# EAGLE design pic16f84a (EAGLE 7.1.0)
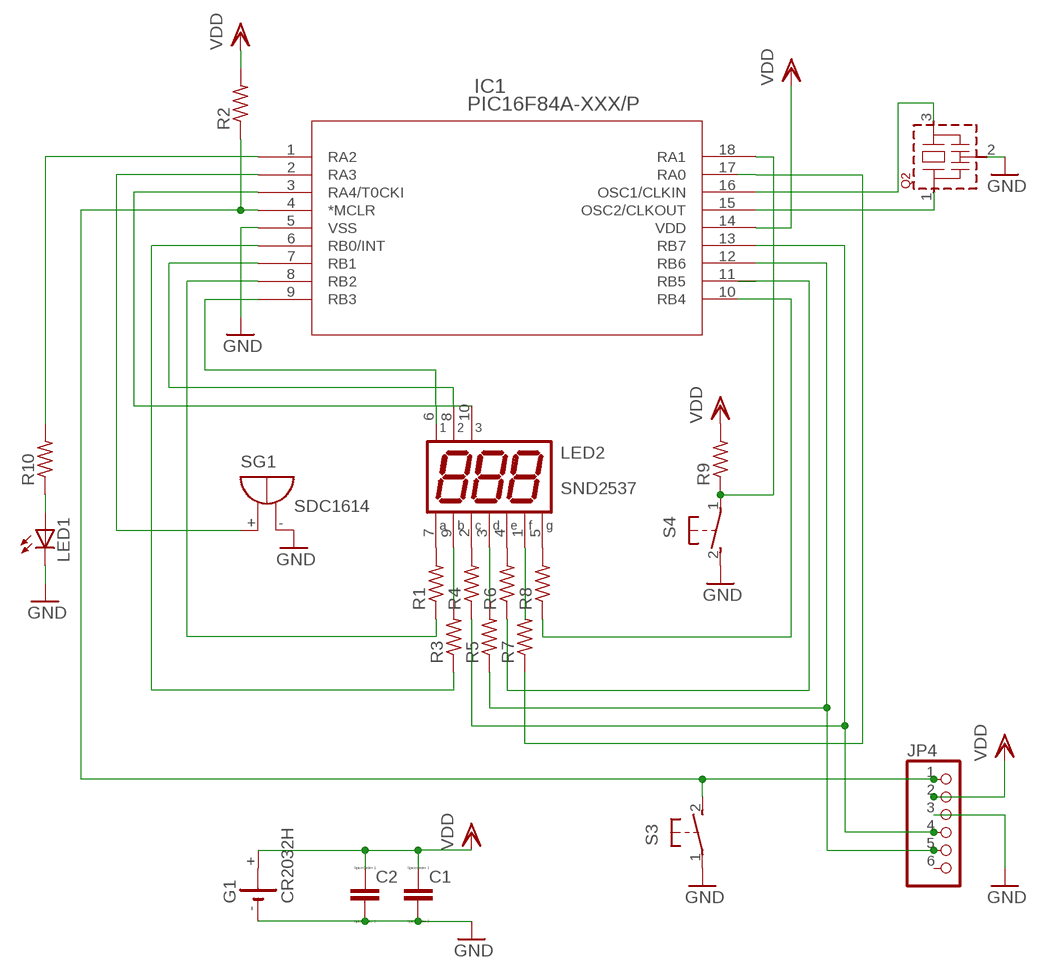
[diagram p0: schematic, sheet 1]

## Parts
C1  C-EU050-025X075  [C050-025X075]
C2  C-EU050-025X075  [C050-025X075]
G1  CR2032H  [CR2032H]
IC1  PIC16F84A-XXX/P  [PDIP18_300MC]
JP4  PINHD-1X6  [1X06]
LED1  LED3MM  [LED3MM]
LED2  SND2537  [SND2537-PKG]
Q2  CSTLS_X  [CSTLS_X]
R1  R-US_0207/10  [0207/10]
R2  R-US_0207/10  [0207/10]
R3  R-US_0207/10  [0207/10]
R4  R-US_0207/10  [0207/10]
R5  R-US_0207/10  [0207/10]
R6  R-US_0207/10  [0207/10]
R7  R-US_0207/10  [0207/10]
R8  R-US_0207/10  [0207/10]
R9  R-US_0207/10  [0207/10]
R10  R-US_0207/10  [0207/10]
S3  31-XX  [B3F-31XX]
S4  31-XX  [B3F-31XX]
SG1  SDC1614  [SDC1614]

## Nets
GND: C1.2 C2.2 G1.- IC1.5(VSS) JP4.3 LED1.K(C) Q2.2(VSS) S3.1(P) S4.2(S) SG1.-
N$1: IC1.13(RB7) JP4.4 R4.1
N$2: IC1.3(RA4/T0CKI) LED2.10
N$3: IC1.10(RB4) R8.1
N$5: IC1.15(OSC2/CLKOUT) Q2.1
N$6: IC1.8(RB2) R1.1
N$7: IC1.2(RA3) SG1.+
N$8: IC1.18(RA1) R9.1 S4.1(P)
N$9: IC1.11(RB5) R6.1
N$10: IC1.1(RA2) R10.2
N$11: IC1.17(RA0) R7.1
N$12: IC1.12(RB6) JP4.5 R5.1
N$13: LED2.7(A) R1.2
N$15: LED2.9(B) R3.2
N$16: LED2.2(C) R4.2
N$17: LED1.A R10.1
N$18: IC1.9(RB3) LED2.6
N$19: LED2.3(D) R5.2
N$20: LED2.4(E) R6.2
N$21: LED2.1(F) R7.2
N$22: LED2.5(G) R8.2
N$23: IC1.16(OSC1/CLKIN) Q2.3
N$25: IC1.7(RB1) LED2.8
N$27: IC1.6(RB0/INT) R3.1
N$29: IC1.4(*MCLR) JP4.1 R2.1 S3.2(S)
VDD: C1.1 C2.1 G1.+ IC1.14(VDD) JP4.2 R2.2 R9.2
Unconnected: JP4.6

## Library data of the parts
C1 C2 = resistor:C-EU: CAPACITOR, European symbol; SPICEPREFIX: C
G1 = cr2032v:CR2032H: LI BATTERY Varta
IC1 = PIC16F84A:PIC16F84A-XXX/P
JP4 = pinhead:PINHD-1X6: PIN HEADER
LED1 = led:LED: LED OSRAM: - CHIPLED LG R971, LG N971, LY N971, LG Q971, LY Q971, LO R971, LY R971 LH N974, LH R974 LS Q976, LO Q976, LY Q976 LO Q996 - Hyper CHIPLED LW Q18S LB Q993, LB Q99A, LB R99A - SideLED LS A670, LO A670, LY A670, LG A670, LP A670 LB A673, LV A673, LT A673, LW A673 LH A674 LY A675 LS A676, LA A676, LO A676, LY A676, LW A676 LS A679, LY A679, LG A679 - Hyper Micro SIDELED® LS Y876, LA Y876, LO Y876, LY Y876 LT Y87S - SmartLED LW L88C, LW L88S LB L89C, LB L89S, LG L890 LS L89K, LO L89K, LY L89K LS L896, LA L896, LO L896, LY L896 - TOPLED LS T670, LO T670, LY T670, LG T670, LP T670 LSG T670, LSP T670, LSY T670, LOP T670, LYG T670 LG T671, LOG T671, LSG T671 LB T673, LV T673, LT T673, LW T673 LH T674 LS T676, LA T676, LO T676, LY T676, LB T676, LH T676, LSB T676, LW T676 LB T67C, LV T67C, LT T67C, LS T67K, LO T67K, LY T67K, LW E67C LS E67B, LA E67B, LO E67B, LY E67B, LB E67C, LV E67C, LT E67C LW T67C LS T679, LY T679, LG T679 LS T770, LO T770, LY T770, LG T770, LP T770 LB T773, LV T773, LT T773, LW T773 LH T774 LS E675, LA E675, LY E675, LS T675 LS T776, LA T776, LO T776, LY T776, LB T776 LHGB T686 LT T68C, LB T68C - Hyper Mini TOPLED® LB M676 - Mini TOPLED Santana® LG M470 LS M47K, LO M47K, LY M47K Source: http://www.osram.convergy.de LUXEON: - LUMILED® LXK2-PW12-R00, LXK2-PW12-S00, LXK2-PW14-U00, LXK2-PW14-V00 LXK2-PM12-R00, LXK2-PM12-S00, LXK2-PM14-U00 LXK2-PE12-Q00, LXK2-PE12-R00, LXK2-PE12-S00, LXK2-PE14-T00, LXK2-PE14-U00 LXK2-PB12-K00, LXK2-PB12-L00, LXK2-PB12-M00, LXK2-PB14-N00, LXK2-PB14-P00, LXK2-PB14-Q00 LXK2-PR12-L00, LXK2-PR12-M00, LXK2-PR14-Q00, LXK2-PR14-R00 LXK2-PD12-Q00, LXK2-PD12-R00, LXK2-PD12-S00 LXK2-PH12-R00, LXK2-PH12-S00 LXK2-PL12-P00, LXK2-PL12-Q00, LXK2-PL12-R00 Source: www.luxeon.com KINGBRIGHT: KA-3528ASYC Source: www.kingbright.com
LED2 = led-7-seg-samkwang:SND2537: SND2537 Triple Digit Seven-Segment Display (anode common); OC_FARNELL: unknown; OC_NEWARK: unknown
Q2 = murata-resonators:CSTLS_X: Ceramic resonator 16.00 to 70.00 MHz
R1-R10 = resistor:R-US_: RESISTOR, American symbol
S3 S4 = switch-omron:31-XX: OMRON SWITCH; MPN: B3F-3100; OC_FARNELL: 959704; OC_NEWARK: 36M3582
SG1 = buzzer_tdk:SDC1614: MAGNETIC TRANSDUCER Source: Http:www.be-star.com; OC_FARNELL: unknown; OC_NEWARK: unknown

## Net classes
0 default: clearance 0.205 mm

## Board
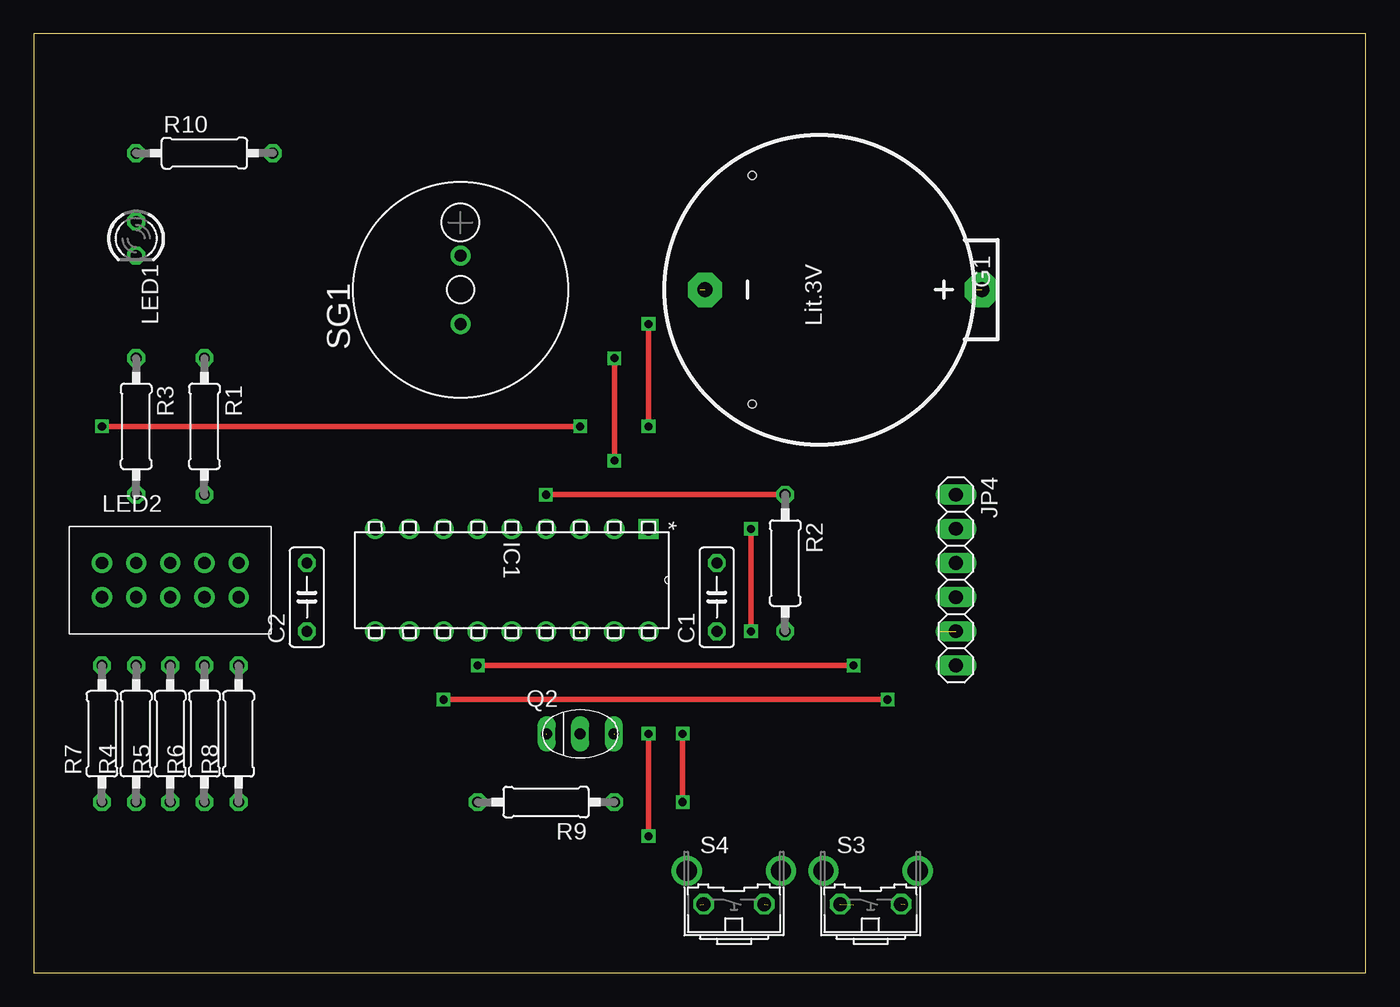
[diagram p1: board, top side]
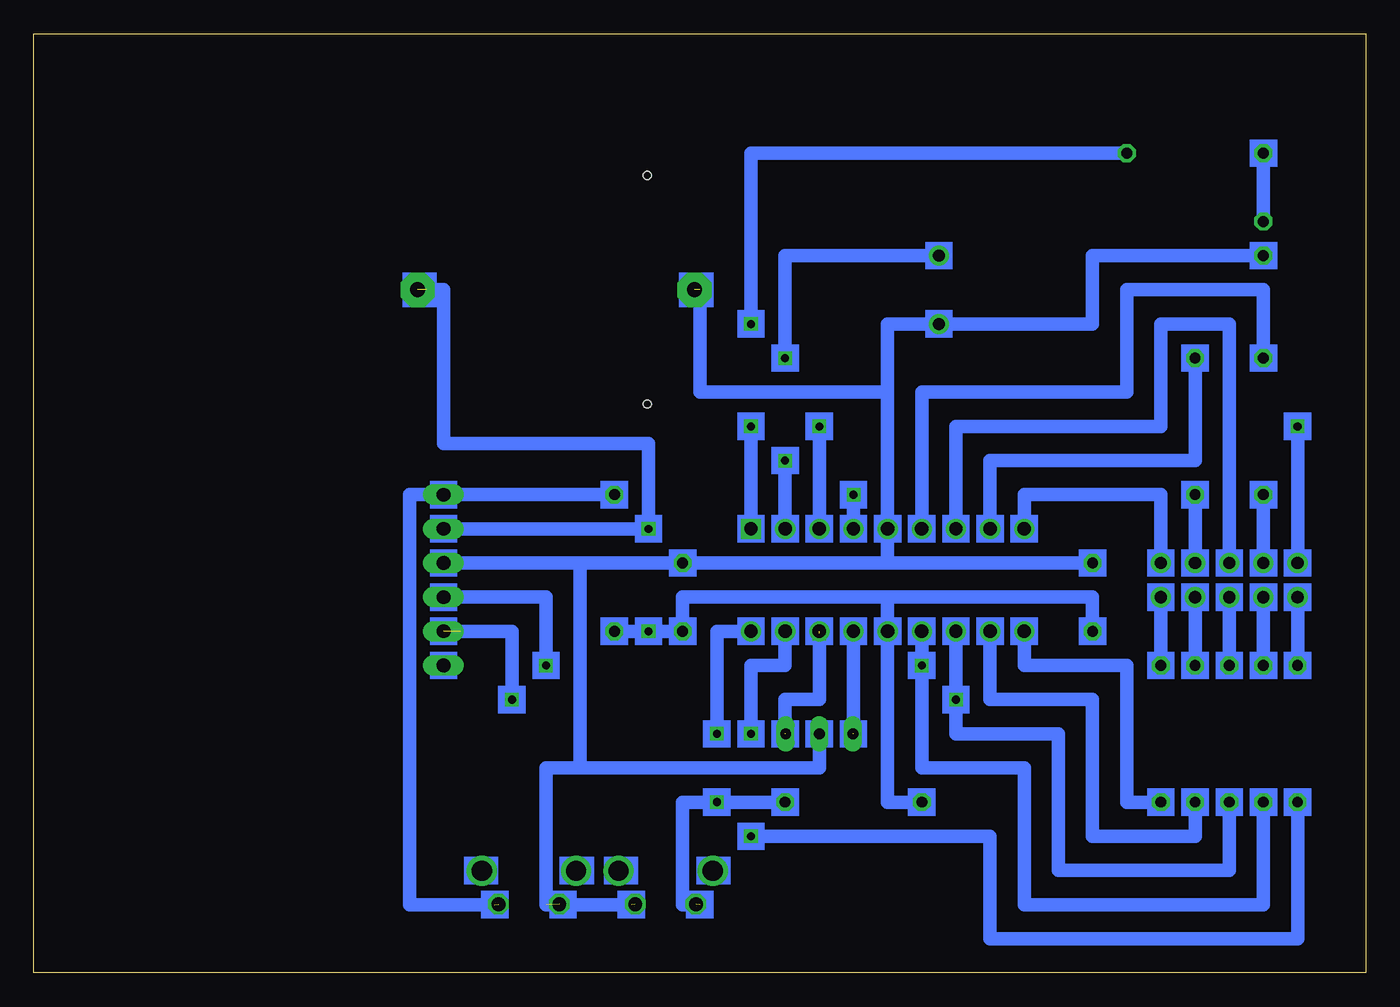
[diagram p2: board, bottom side, seen from below]

Size 99.06 x 69.85 mm. Coordinates in mm from the lower left corner, seen from the top.
Outline: 0,0 99.06,0 99.06,69.85 0,69.85 0,0
Copper layers (1*16): Top 0.035mm / dielectric 1.5mm / Bottom 0.035mm
Design rules "default": minimum track width 10mil, minimum drill 24mil, track to track 8mil, track to pad 8mil, pad to pad 8mil, via to via 8mil, smd to smd 8mil, copper to edge 40mil, drill to drill 8mil, minimum pad ring 10mil, minimum via ring 8mil, stop-mask expansion 4mil, vias tented up to drill 0mil, thermal gap 10mil

### Footprints (pad centres in the part's own frame; a part is rotated, then mirrored left to right if it is on the bottom)
C050-025X075 = drill 0.813 octagon: 1 -2.54,0; 2 2.54,0
CR2032H = drill 1.118 pad 2.54 octagon: + 0,12.1; - 0,-8.5 | hole 0.6: -8.5,-5; 8.5,-5
PDIP18_300MC = drill 0.991 square: 1 -7.62,20.32 | drill 0.991: 2 -7.62,17.78; 3 -7.62,15.24; 4 -7.62,12.7; 5 -7.62,10.16; 6 -7.62,7.62; 7 -7.62,5.08; 8 -7.62,2.54; 9 -7.62,0; 10 0,0; 11 0,2.54; 12 0,5.08; 13 0,7.62; 14 0,10.16; 15 0,12.7; 16 0,15.24; 17 0,17.78; 18 0,20.32
1X06 = drill 1.016 long: 1 -6.35,0; 2 -3.81,0; 3 -1.27,0; 4 1.27,0; 5 3.81,0; 6 6.35,0
LED3MM = drill 0.813 octagon: A -1.27,0; K 1.27,0
SND2537-PKG = drill 0.9 pad 1.5: 1 -5.08,-1.27; 2 -2.54,-1.27; 3 0,-1.27; 4 2.54,-1.27; 5 5.08,-1.27; 6 5.08,1.27; 7 2.54,1.27; 8 0,1.27; 9 -2.54,1.27; 10 -5.08,1.27
CSTLS_X = drill 0.813 long: 1 -2.5,0; 2 0,0; 3 2.5,0
0207/10 = drill 0.813 octagon: 1 -5.08,0; 2 5.08,0
B3F-31XX = drill 1.016 octagon: 1 -2.261,-1.245; 2 2.261,-1.245 | drill 1.499 pad 2.159: 3 -3.505,1.245; 4 3.505,1.245
SDC1614 = drill 0.9 pad 1.5: + 2.54,0; - -2.54,0

### Placement (x,y rotation side)
C1  50.8,27.94 90 top
C2  20.32,27.94 90 top
G1  58.42,50.8 270 top
IC1  25.4,25.4 270 top
JP4  68.58,29.21 270 top
LED1  7.62,54.61 270 top
LED2  10.16,29.21 0 top
Q2  40.64,17.78 0 top
R1  12.7,40.64 270 top
R2  55.88,30.48 270 top
R3  7.62,40.64 270 top
R4  7.62,17.78 90 top
R5  10.16,17.78 90 top
R6  12.7,17.78 90 top
R7  5.08,17.78 90 top
R8  15.24,17.78 90 top
R9  38.1,12.7 180 top
R10  12.7,60.96 0 top
S3  62.23,6.35 0 top
S4  52.07,6.35 0 top
SG1  31.75,50.8 90 top

### Tracks (layer width: path | path; a pad name or v marks a point on that pad's centre or on a via)
GND  (3 unrouted)
  Bottom 1.016: C2.2 35.56,30.48 | 35.56,30.48 C1.2 58.42,30.48 | 35.56,30.48 IC1.5 35.56,43.18 | 35.56,43.18 49.53,43.18 49.53,50.8 | 35.56,43.18 35.56,48.26 SG1.- 20.32,48.26 20.32,53.34 LED1.K | Q2.2 40.64,15.24 58.42,15.24 | 58.42,15.24 58.42,30.48 | JP4.3 58.42,30.48 | 54.61,5.08 60.96,5.08 60.96,15.24 58.42,15.24
N$1  (via drill 0.6)
  Top 0.406: v33.02,22.86 v60.96,22.86
  Bottom 1.016: R4.1 7.62,5.08 25.4,5.08 25.4,15.24 33.02,15.24 v33.02,22.86 IC1.13 | v60.96,22.86 60.96,27.94 JP4.4
N$2  (via drill 0.6)
  Top 0.406: v5.08,40.64 v40.64,40.64
  Bottom 1.016: LED2.10 v5.08,40.64 | v40.64,40.64 IC1.3
N$3
  Bottom 1.016: R8.1 17.78,12.7 17.78,22.86 25.4,22.86 IC1.10
N$5  (1 unrouted)
  Bottom 1.016: IC1.15 38.1,17.78
N$6
  Bottom 1.016: R1.1 12.7,38.1 27.94,38.1 IC1.8
N$7  (via drill 0.6)
  Top 0.406: v43.18,38.1 v43.18,45.72
  Bottom 1.016: v43.18,45.72 43.18,53.34 SG1.+ | v43.18,38.1 IC1.2
N$8  (via drill 0.6)  (1 unrouted)
  Top 0.406: v48.26,17.78 v48.26,12.7
  Bottom 1.016: R9.1 v48.26,12.7 50.8,12.7 50.8,5.08 49.53,5.08 | IC1.18 48.26,25.4 v48.26,17.78
N$9
  Bottom 1.016: R6.1 12.7,10.16 20.32,10.16 20.32,20.32 27.94,20.32 IC1.11
N$10  (via drill 0.6)
  Top 0.406: v45.72,48.26 v45.72,40.64
  Bottom 1.016: R10.2 45.72,60.96 v45.72,48.26 | v45.72,40.64 IC1.1
N$11  (via drill 0.6)
  Top 0.406: v45.72,10.16 v45.72,17.78
  Bottom 1.016: R7.1 5.08,2.54 27.94,2.54 27.94,10.16 v45.72,10.16 | v45.72,17.78 45.72,22.86 43.18,22.86 IC1.17
N$12  (via drill 0.6)  (1 unrouted)
  Top 0.406: v30.48,20.32 v63.5,20.32
  Bottom 1.016: R5.1 10.16,7.62 22.86,7.62 22.86,17.78 30.48,17.78 v30.48,20.32 IC1.12 | v63.5,20.32 63.5,25.4 JP4.5
N$13
  Bottom 1.016: LED2.7 R1.2
N$15
  Bottom 1.016: LED2.9 R3.2
N$16
  Bottom 1.016: LED2.2 R4.2
N$17
  Bottom 1.016: R10.1 LED1.A
N$18
  Bottom 1.016: LED2.6 15.24,35.56 25.4,35.56 IC1.9
N$19
  Bottom 1.016: LED2.3 R5.2
N$20
  Bottom 1.016: LED2.4 R6.2
N$21
  Bottom 1.016: LED2.1 R7.2
N$22
  Bottom 1.016: LED2.5 R8.2
N$23  (via drill 0.6)  (2 unrouted)
  Bottom 1.016: v40.64,25.25 40.64,20.32 43.18,20.32 v43.18,17.78
N$25
  Bottom 1.016: LED2.8 10.16,48.26 15.24,48.26 15.24,40.64 30.48,40.64 IC1.7
N$27
  Bottom 1.016: R3.1 7.62,50.8 17.78,50.8 17.78,43.18 33.02,43.18 IC1.6
N$29  (via drill 0.6)  (1 unrouted)
  Top 0.406: R2.1 v38.1,35.56
  Bottom 1.016: R2.1 JP4.1 71.12,35.56 71.12,5.08 64.77,5.08 | v38.1,35.56 IC1.4
VDD  (via drill 0.6)  (1 unrouted)
  Top 0.406: v53.34,33.02 v53.34,25.4
  Bottom 1.016: C2.1 20.32,27.94 35.56,27.94 | 35.56,27.94 50.8,27.94 C1.1 v53.34,25.4 R2.2 | 35.56,27.94 IC1.14 35.56,12.7 R9.2 | JP4.2 v53.34,33.02 53.34,39.37 68.58,39.37 68.58,50.8 69.85,50.8
(copper drawn outside any net)
  shapes: Bottom area x90